# Altium project PCB_Project.PrjPCB
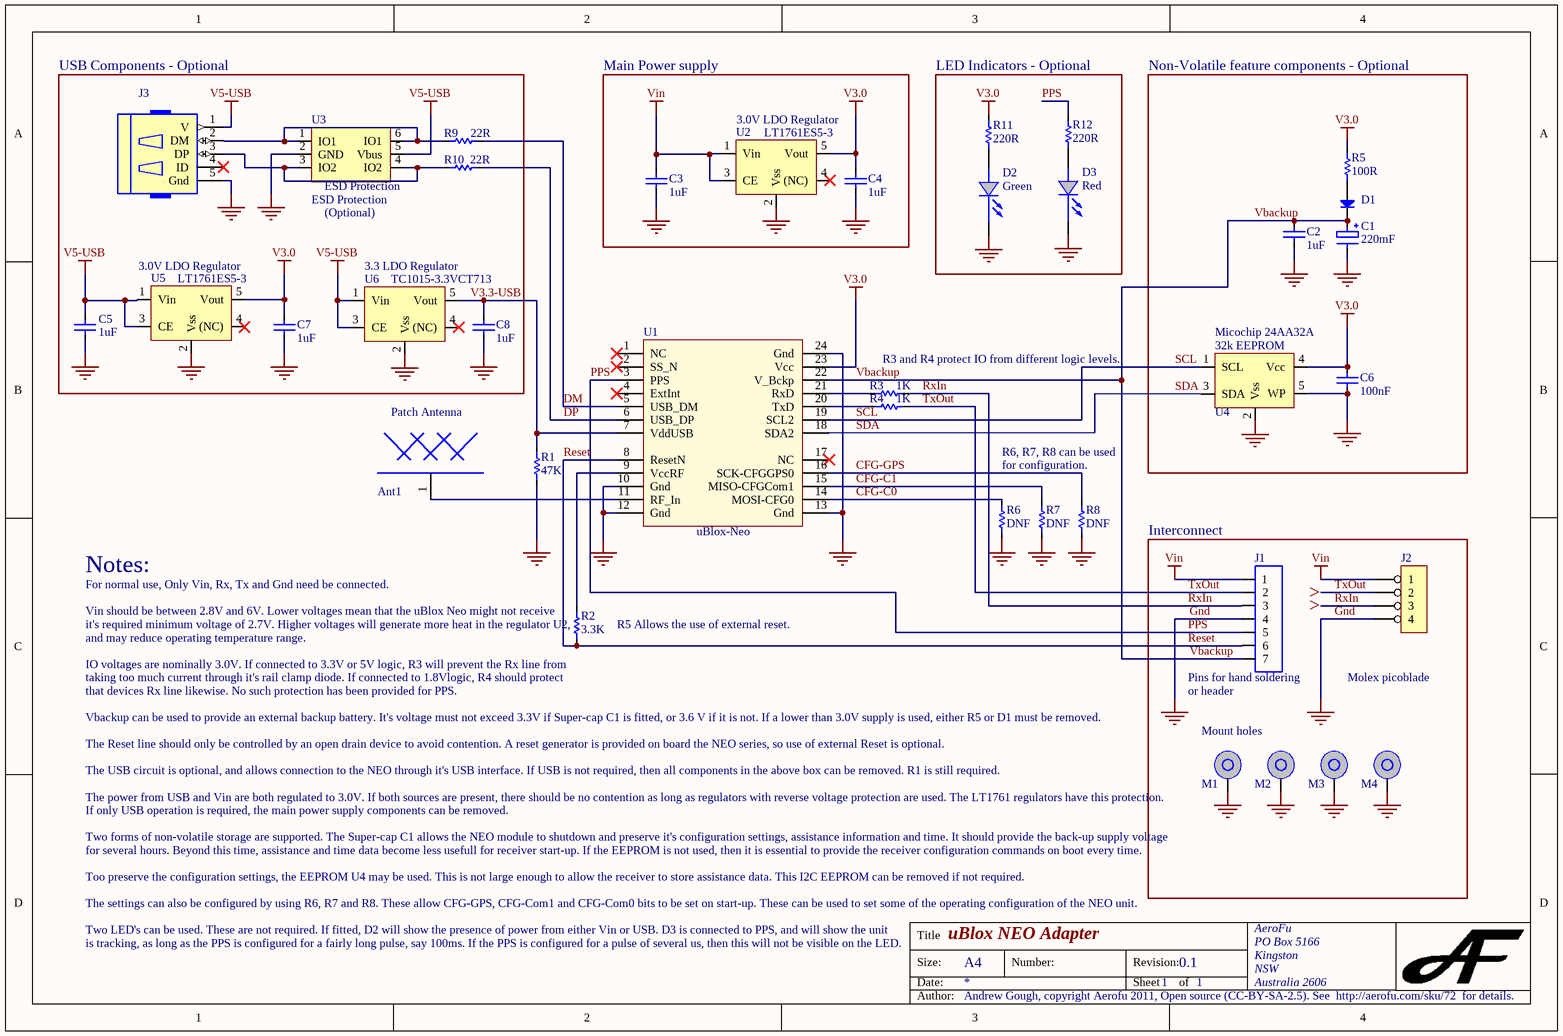
[diagram p0: Schematic.SchDoc]
1 sheet, 37 parts. Net scope: global (net labels, ports and power ports of the same name join across sheets).
Board file: PCB.PcbDoc

## Sheet Schematic.SchDoc: uBlox NEO Adapter
size A4; Author: Andrew Gough, copyright Aerofu 2011, Open source (CC-BY-SA-2.5). See  http://aerofu.com/sku/72  for details.; Organization: AeroFu; Address1: PO Box 5166; Address2: Kingston; Address3: NSW; Address4: Australia 2606; Revision: 0.1; SheetNumber: 1; SheetTotal: 1; PageSetup: Record=PageOptions|CenterHorizontal=True|CenterVertical=True|PrintScale=1.00|XCorrection=1.00|YCorrection=1.00|PrintKind=0|BorderSize=5000000|LeftOffset=0|BottomOffset=0|Orientation=2|PaperLength=1000|PaperWidth=1000|Scale=100|PaperSource=7|PrintQuality=-4|MediaType=1|DitherType=10|PaperKind=A4|PrintScaleMode=1

### Parts
Ant1  Patch Antenna  [Patch-25mm]
C1  value 220mF  [Supercap-6.8mm]  (hidden comment: Capacitor_SuperCap)
C2  value 1uF  [0603]  (hidden comment: Capacitor)
C3  value 1uF  [0603]  (hidden comment: Capacitor)
C4  value 1uF  [0603]  (hidden comment: Capacitor)
C5  value 1uF  [0603]  (hidden comment: Capacitor)
C6  value 100nF  [0603]  (hidden comment: Capacitor)
C7  value 1uF  [0603]  (hidden comment: Capacitor)
C8  value 1uF  [0603]  (hidden comment: Capacitor)
D1  Diode BAS116  [SOT23-3]  (value not drawn)
D2  Green  [0603 - LED]
D3  Red  [0603 - LED]
J1  SPI Header  [HDR7X1-2.54]  (value not drawn)
J2  Socket 4x1  [Molex Picoblade 4 Pin socket]  (value not drawn)
J3  USB-MiniB  [Mini-USB]  (value not drawn)
M1  Screw Hole  [MOUNT HOLE]  (value not drawn)
M2  Screw Hole  [MOUNT HOLE]  (value not drawn)
M3  Screw Hole  [MOUNT HOLE]  (value not drawn)
M4  Screw Hole  [MOUNT HOLE]  (value not drawn)
R1  value 47K  [0603]  (hidden comment: Resistor)
R2  value 3.3K  [0603]  (hidden comment: Resistor)
R3  value 1K  [0603]  (hidden comment: Resistor)
R4  value 1K  [0603]  (hidden comment: Resistor)
R5  value 100R  [0603]  (hidden comment: Resistor)
R6  value DNF  [0603]  (hidden comment: Resistor)
R7  value DNF  [0603]  (hidden comment: Resistor)
R8  value DNF  [0603]  (hidden comment: Resistor)
R9  value 22R  [0603]  (hidden comment: Resistor)
R10  value 22R  [0603]  (hidden comment: Resistor)
R11  value 220R  [0603]  (hidden comment: Resistor)
R12  value 220R  [0603]  (hidden comment: Resistor)
U1  uBlox-Neo  [uBlox-NEO]
U2  LT1761ES5-3  [Sot23-5]
U3  ESD Protection  [Sot23-6]
U4  32k EEPROM  [Sot23-5]
U5  LT1761ES5-3  [Sot23-5]
U6  TC1015-3.3VCT713  [Sot23-5]

### Blocks framed on the sheet
USB Components - Optional: C5 C7 C8 J3 R9 R10 U3 U5 U6
Main Power supply: C3 C4 U2
LED Indicators - Optional: D2 D3 R11 R12
Non-Volatile feature components - Optional: C1 C2 C6 D1 R5 U4

### Nets
Gnd: C1.1 C2.1 C3.1 C4.1 C5.1 C6.1 C7.1 C8.1 D2.2(CATHODE) D3.2(CATHODE) J1.4 J2.4 J3.5(MT) M1.1 M2.1 M3.1 M4.1 R1.1 R6.1 R7.1 R8.1 U1.10(Gnd) U1.12(Gnd) U1.13(Gnd) U1.24(Gnd) U2.2(Vss) U3.2(GND) U4.2(Vss) U4.5(WP) U5.2(Vss) U6.2(Vss)
V3.0: C4.2 C6.2 C7.2 R5.2 R11.2 U1.23(Vcc) U2.5(Vout) U4.4(Vcc) U5.5(Vout)
V5-USB: C5.2 J3.1(V) U3.5(Vbus) U5.1(Vin) U5.3(CE) U6.1(Vin) U6.3(CE)
Vin: C3.2 J1.1 J2.1 U2.1(Vin) U2.3(CE)
CFG-C0: R6.2 U1.14(MOSI-CFG0)
CFG-C1: R7.2 U1.15(MISO-CFGCom1)
CFG-GPS: R8.2 U1.16(SCK-CFGGPS0)
DM: R9.1 U1.5(USB_DM)
DP: R10.1 U1.6(USB_DP)
PPS: J1.5 R12.2 U1.3(PPS)
Reset: J1.6 R2.1 U1.8(ResetN)
RxIn: J1.3 J2.3 R3.1
SCL: U1.19(SCL2) U4.1(SCL)
SDA: U1.18(SDA2) U4.3(SDA)
TxOut: J1.2 J2.2 R4.1
V3.3-USB: C8.2 R1.2 U1.7(VddUSB) U6.5(Vout)
Vbackup: C1.2 C2.2 D1.3(K) J1.7 U1.22(V_Bckp)
NetAnt1_1: Ant1.1 U1.11(RF_In)
NetD1_1: D1.1(A) R5.1
NetD2_1: D2.1(ANODE) R11.1
NetD3_1: D3.1(ANODE) R12.1
NetJ3_2: J3.2(DM) R9.2 U3.1(IO1) U3.6(IO1)
NetJ3_3: J3.3(DP) R10.2 U3.3(IO2) U3.4(IO2)
NetR2_2: R2.2 U1.9(VccRF)
NetR3_2: R3.2 U1.21(RxD)
NetR4_2: R4.2 U1.20(TxD)

Not connected (* = marked no-connect by the designer): J3 4(ID)* 6(MT); U1 1(NC)* 2(SS_N)* 4(ExtInt)* 17(NC)*; U2 4((NC))*; U5 4((NC)); U6 4((NC))*

### Notes on the sheet
- (near U2) 3.0V LDO Regulator
- (near U3) ESD Protection
- (near U3) (Optional)
- (near U5) 3.0V LDO Regulator
- (near U6) 3.3 LDO Regulator
- R3 and R4 protect IO from different logic levels.
- (near U4) Micochip 24AA32A
- R6, R7, R8 can be used
- for configuration.
- Notes:
- Interconnect
- For normal use, Only Vin, Rx, Tx and Gnd need be connected.
- (near R2) Vin should be between 2.8V and 6V. Lower voltages mean that the uBlox Neo might not receive
- (near R2) it's required minimum voltage of 2.7V. Higher voltages will generate more heat in the regulator U2,
- and may reduce operating temperature range.
- (near R2) R5 Allows the use of external reset.
- <
- (near R2) IO voltages are nominally 3.0V. If connected to 3.3V or 5V logic, R3 will prevent the Rx line from
- (near R2) taking too much current through it's rail clamp diode. If connected to 1.8Vlogic, R4 should protect
- that devices Rx line likewise. No such protection has been provided for PPS.
- Vbackup can be used to provide an external backup battery. It's voltage must not exceed 3.3V if Super-cap C1 is fitted, or 3.6 V if it is not. If a lower than 3.0V supply is used, either R5 or D1 must be removed.
- (near J1) Pins for hand soldering
- (near J1) or header
- Molex picoblade
- The Reset line should only be controlled by an open drain device to avoid contention. A reset generator is provided on board the NEO series, so use of external Reset is optional.
- (near M1) The USB circuit is optional, and allows connection to the NEO through it's USB interface. If USB is not required, then all components in the above box can be removed. R1 is still required.
- Mount holes
- The power from USB and Vin are both regulated to 3.0V. If both sources are present, there should be no contention as long as regulators with reverse voltage protection are used. The LT1761 regulators have this protection.
- If only USB operation is required, the main power supply components can be removed.
- Two forms of non-volatile storage are supported. The Super-cap C1 allows the NEO module to shutdown and preserve it's configuration settings, assistance information and time. It should provide the back-up supply voltage
- for several hours. Beyond this time, assistance and time data become less usefull for receiver start-up. If the EEPROM is not used, then it is essential to provide the receiver configuration commands on boot every time.
- Too preserve the configuration settings, the EEPROM U4 may be used. This is not large enough to allow the receiver to store assistance data. This I2C EEPROM can be removed if not required.
- The settings can also be configured by using R6, R7 and R8. These allow CFG-GPS, CFG-Com1 and CFG-Com0 bits to be set on start-up. These can be used to set some of the operating configuration of the NEO unit.
- Two LED's can be used. These are not required. If fitted, D2 will show the presence of power from either Vin or USB. D3 is connected to PPS, and will show the unit
- is tracking, as long as the PPS is configured for a fairly long pulse, say 100ms. If the PPS is configured for a pulse of several us, then this will not be visible on the LED.
- Title
- Size:
- Date:
- A4
- Number:
- Revision:
- Sheet
- of
- Author:

### Library data of the parts
C1 = Capacitor_SuperCap: SuperCap; Voltage rating: *
C2-C8 = Capacitor: Capacitor (Semiconductor SIM Model); Voltage rating: *
D1 = Diode BAS116: Silicon Low Leakage Diode; Note: Pin 2 is not connected and not drawn.; Published: 21-Mar-2003; DatasheetDocument: Oct-1999; PackageDocument: Sep-2001; PackageReference: SOT-23; Publisher: Altium Limited
D2 D3 = LED: Part Field 3: 160-1421-1-ND; Part Field 2: Digikey; RoHS: Y
J1 = 7 Way header 7x1
J2 = 4 Way Socket 4x1: Socket; Part Field 2: Samtec; Part Field 3: CLP-110-02-G-D-A; RoHS: Y
J3 = USB-MiniB: USB Connector
M1-M4 = Screw Hole: Mount Hole; Comp: MECH
U2 U5 U6 = Regulator-5Pin
U3 = USBLC6-2
U4 = 24AA32A